# EAGLE design CORE (EAGLE 5.06)
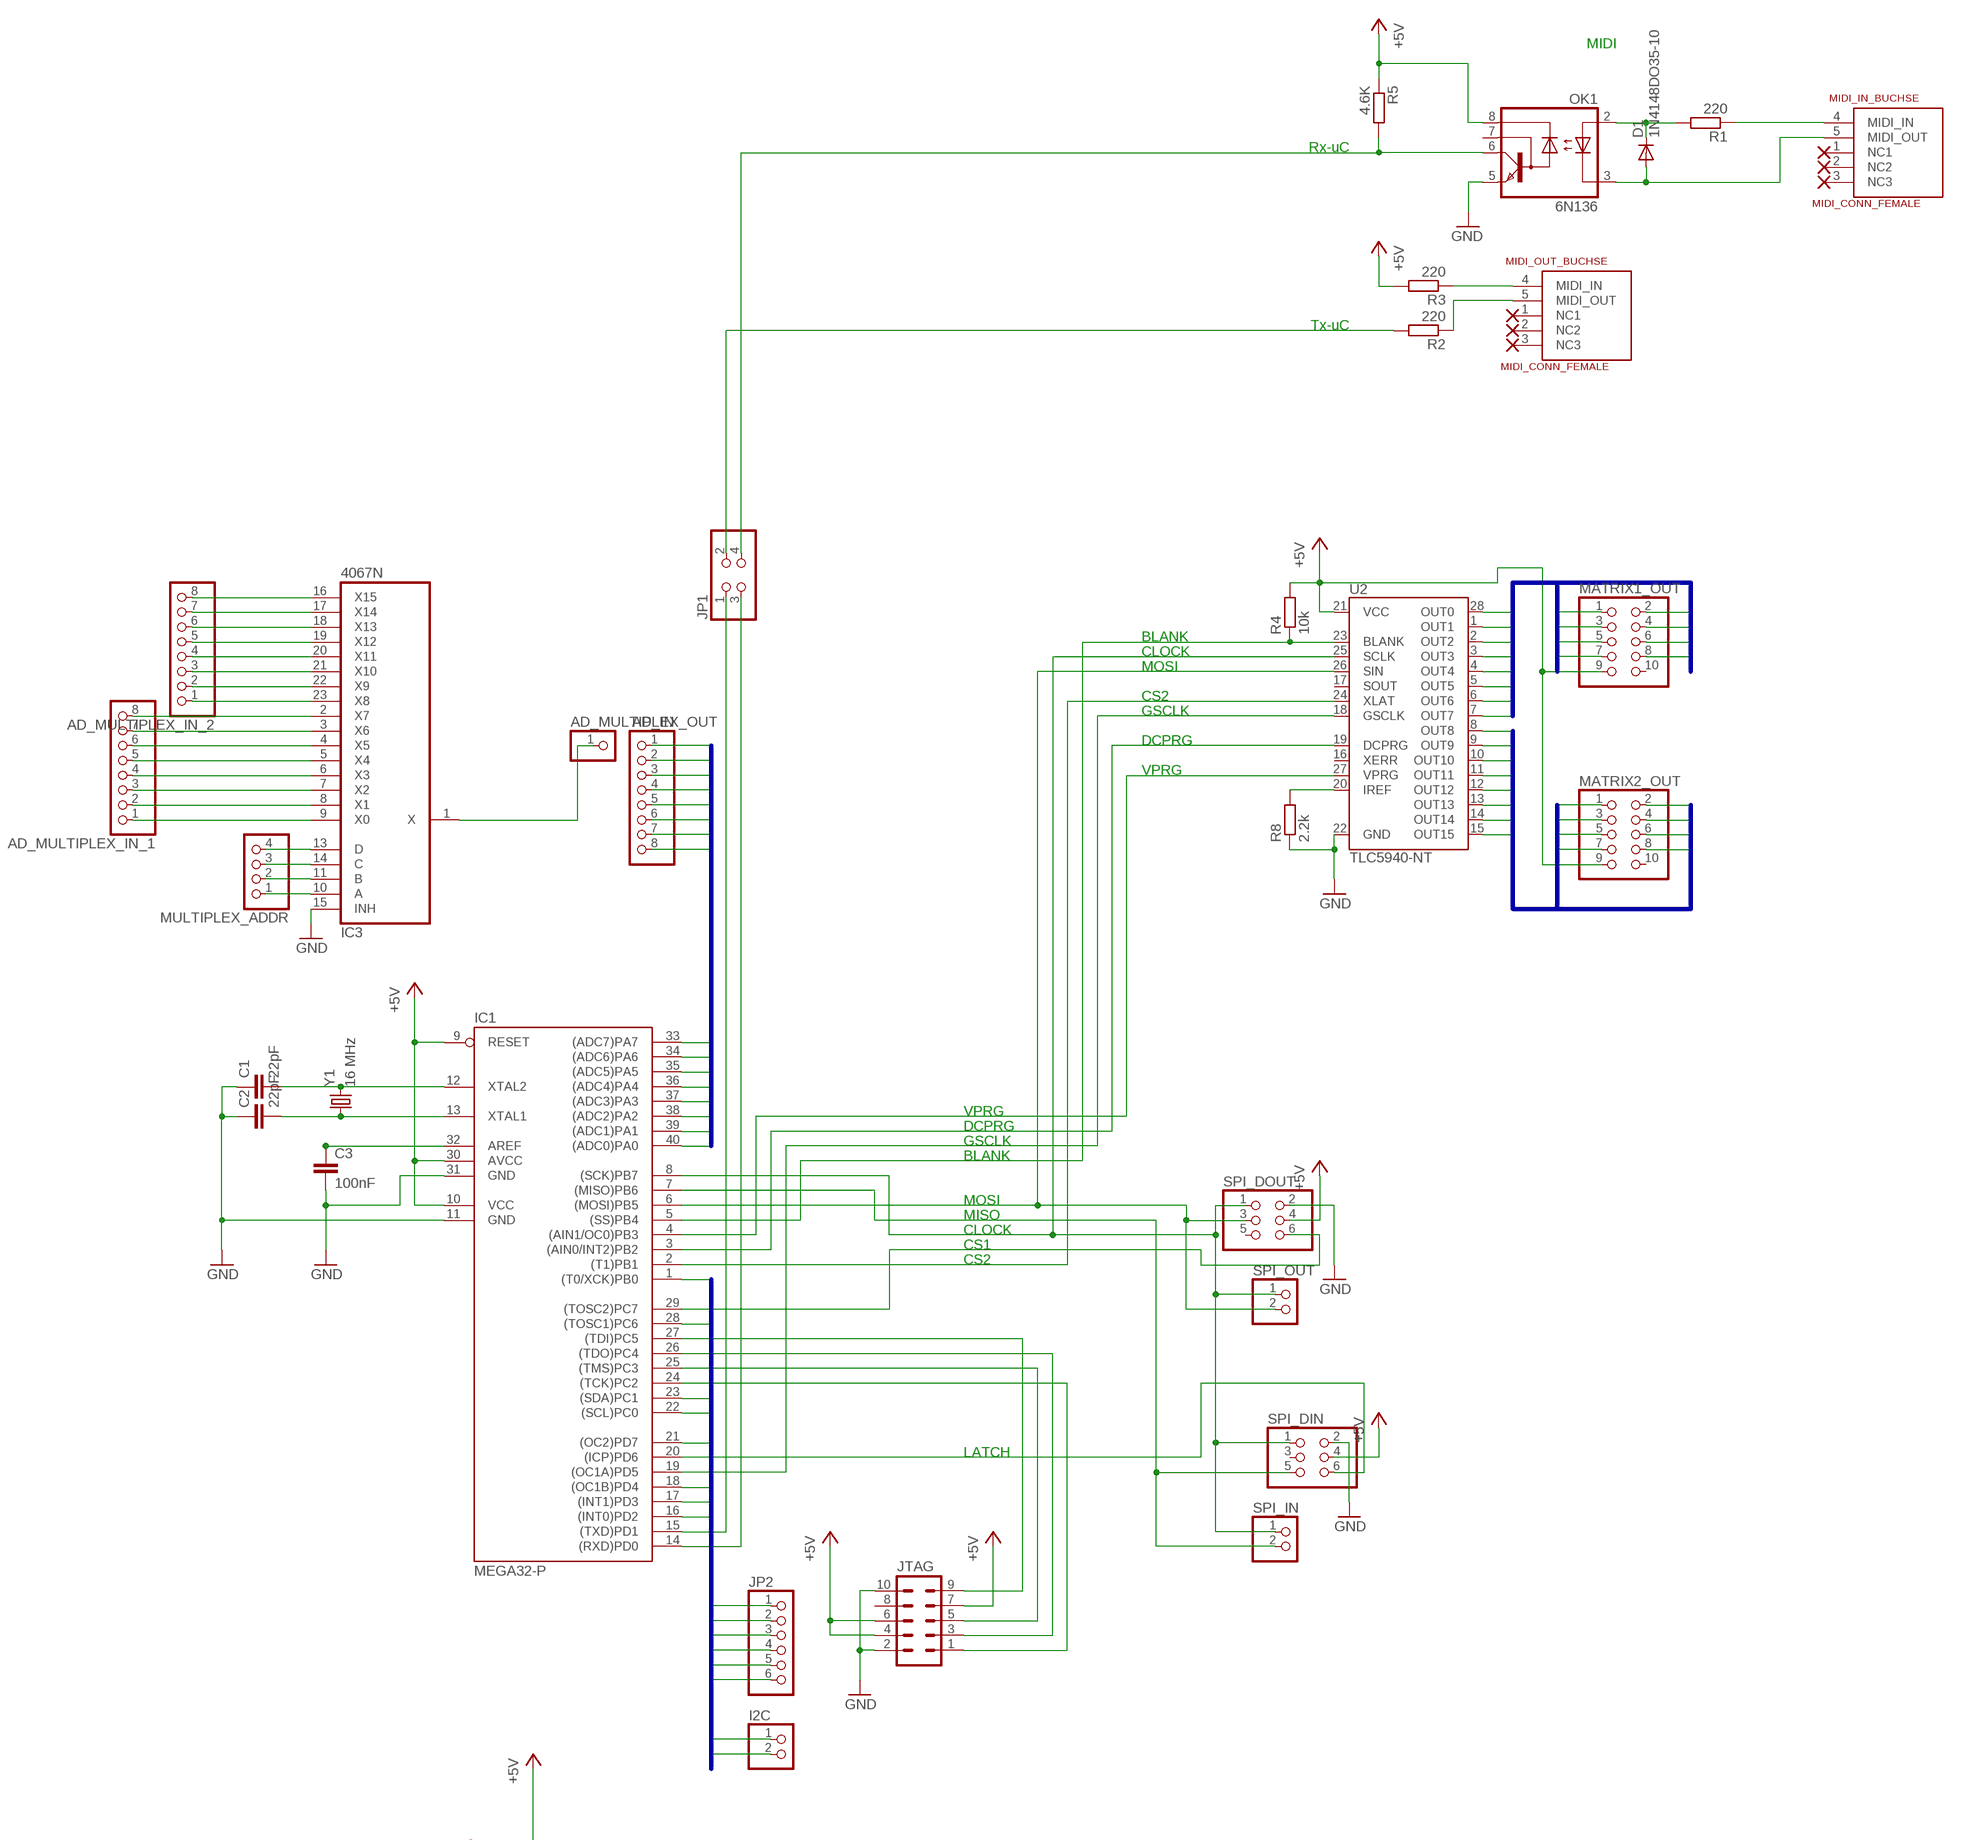
[diagram p0: schematic, sheet 1, part 1 of 2]
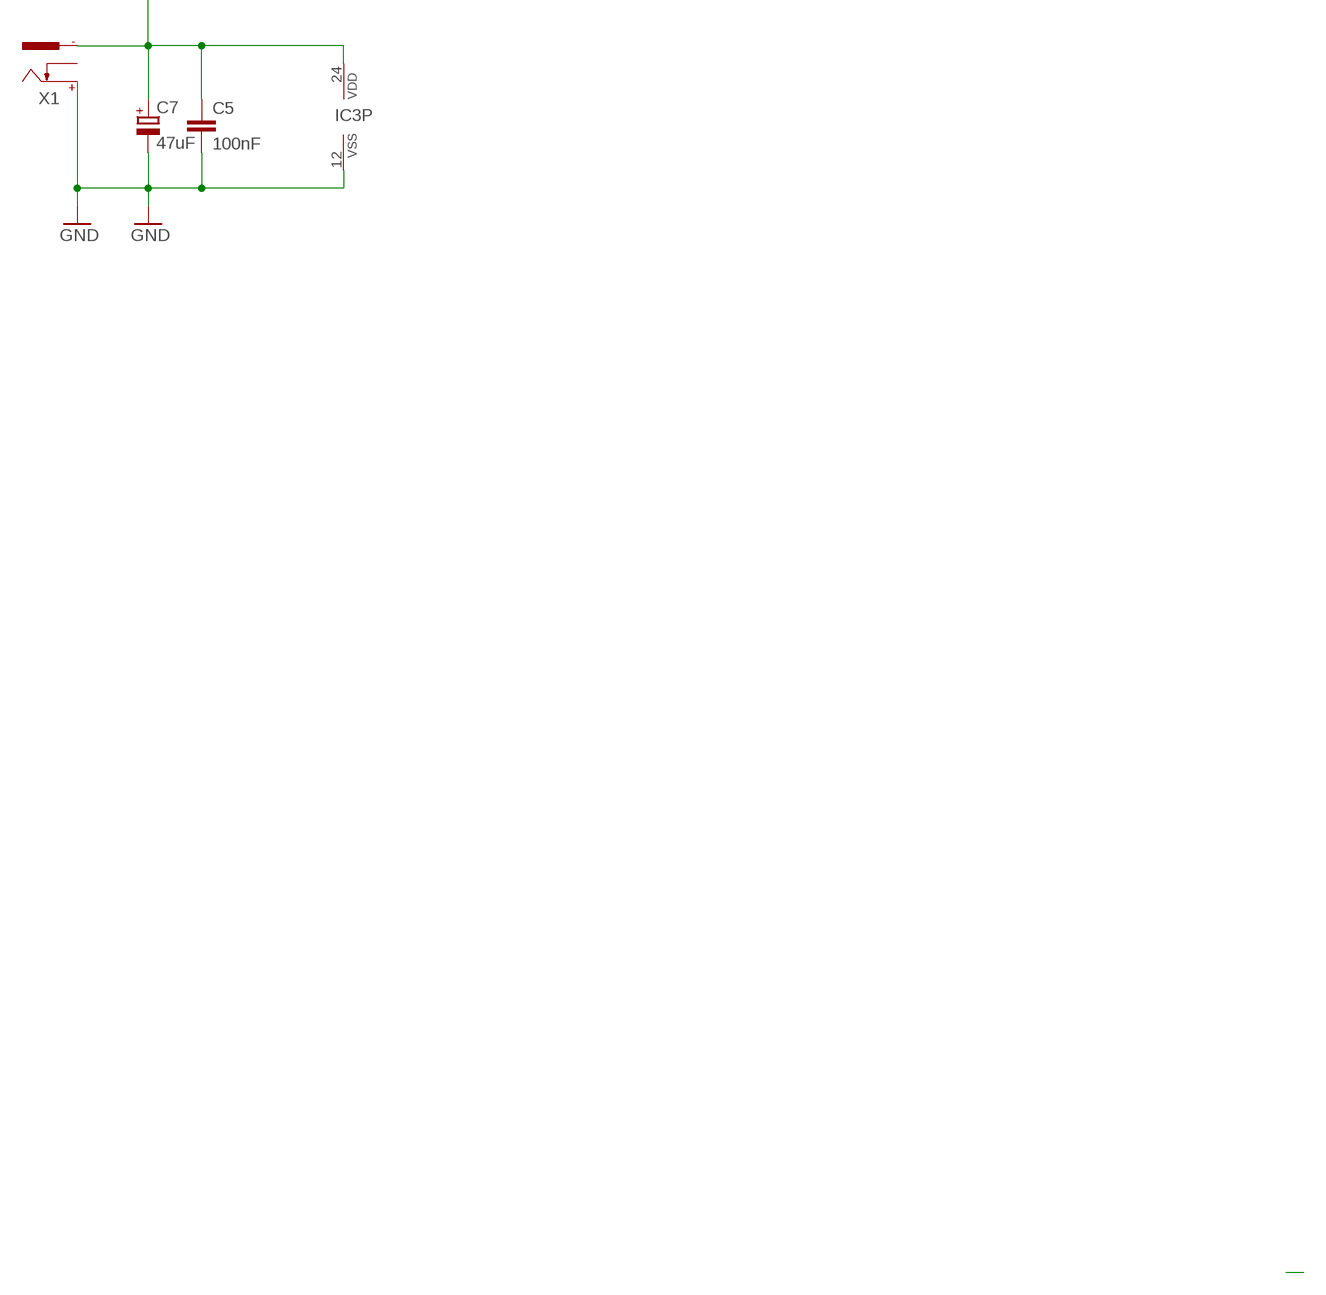
[diagram p1: schematic, sheet 1, part 2 of 2]

## Parts
AD_IN  PINHD-1X8  [1X08]
AD_MULTIPLEX_IN_1  PINHD-1X8  [1X08]
AD_MULTIPLEX_IN_2  PINHD-1X8  [1X08]
AD_MULTIPLEX_OUT  PINHD-1X1  [1X01]
C1  22pF  C-EU025-024X044  [C025-024X044]
C2  22pF  C-EU025-024X044  [C025-024X044]
C3  100nF  C-EU025-025X050  [C025-025X050]
C5  100nF  C-EU025-025X050  [C025-025X050]
C7  47uF  CPOL-EUE2.5-6  [E2,5-6]
D1  1N4148DO35-10  [DO35-10]
I2C  PINHD-1X2  [1X02]
IC1  MEGA32-P  [DIL40]
IC3  4067N  [DIL24-6]
JP1  PINHD-2X2  [2X02]
JP2  PINHD-1X6  [1X06]
JTAG  ML10  [ML10]
MATRIX1_OUT  PINHD-2X5  [2X05]
MATRIX2_OUT  PINHD-2X5  [2X05]
MIDI_IN_BUCHSE  MIDI_CONN_FEMALE  [DIN_5_FEMALE]
MIDI_OUT_BUCHSE  MIDI_CONN_FEMALE  [DIN_5_FEMALE]
MULTIPLEX_ADDR  PINHD-1X4  [1X04]
OK1  6N136  6N135  [DIL08]
R1  220  R-EU_0207/10  [0207/10]
R2  220  R-EU_0207/10  [0207/10]
R3  220  R-EU_0207/10  [0207/10]
R4  10k  R-EU_0207/10  [0207/10]
R5  4.6K  R-EU_0207/10  [0207/10]
R8  2.2k  R-EU_0207/10  [0207/10]
SPI_DIN  PINHD-2X3  [2X03]
SPI_DOUT  PINHD-2X3  [2X03]
SPI_IN  PINHD-1X2  [1X02]
SPI_OUT  PINHD-1X2  [1X02]
U2  TLC5940-NT  [DIL28-3]
X1  737992-55  [737992-5]
Y1  16 MHz  CRYSTALHC49UV  [HC49U-V]

## Nets
+5V: C5.1 C7.+ IC1.9(RESET) IC1.10(VCC) IC1.30(AVCC) IC3.24(VDD) JTAG.4 JTAG.6 JTAG.7 MATRIX1_OUT.9 MATRIX2_OUT.9 OK1.8(VCC) R3.2 R4.2 R5.1 SPI_DIN.4 SPI_DOUT.4 U2.21(VCC) X1.-1
AD1: AD_IN.1 IC1.40((ADC0)PA0)
AD2: AD_IN.2 IC1.39((ADC1)PA1)
AD3: AD_IN.3 IC1.38((ADC2)PA2)
AD4: AD_IN.4 IC1.37((ADC3)PA3)
AD5: AD_IN.5 IC1.36((ADC4)PA4)
AD6: AD_IN.6 IC1.35((ADC5)PA5)
AD7: AD_IN.7 IC1.34((ADC6)PA6)
AD8: AD_IN.8 IC1.33((ADC7)PA7)
GND: C1.1 C2.1 C3.2 C5.2 C7.- IC1.11(GND) IC1.31(GND) IC3.12(VSS) IC3.15(INH) JTAG.2 JTAG.10 OK1.5(GND) R8.1 SPI_DIN.2 SPI_DOUT.2 U2.22(GND) X1.+
INT0/PD2: IC1.16((INT0)PD2) JP2.6
INT1/PD3: IC1.17((INT1)PD3) JP2.5
N$1: C2.2 IC1.13(XTAL1) Y1.1
N$2: C1.2 IC1.12(XTAL2) Y1.2
N$3: IC1.2((T1)PB1) U2.24(XLAT)
N$4: AD_MULTIPLEX_OUT.1 IC3.1(X)
N$5: AD_MULTIPLEX_IN_1.1 IC3.9(X0)
N$6: AD_MULTIPLEX_IN_1.2 IC3.8(X1)
N$7: AD_MULTIPLEX_IN_1.3 IC3.7(X2)
N$8: AD_MULTIPLEX_IN_1.4 IC3.6(X3)
N$9: AD_MULTIPLEX_IN_1.5 IC3.5(X4)
N$10: AD_MULTIPLEX_IN_1.6 IC3.4(X5)
N$11: AD_MULTIPLEX_IN_1.7 IC3.3(X6)
N$12: AD_MULTIPLEX_IN_1.8 IC3.2(X7)
N$13: AD_MULTIPLEX_IN_2.1 IC3.23(X8)
N$14: AD_MULTIPLEX_IN_2.2 IC3.22(X9)
N$15: JP1.4 OK1.6(VO) R5.2
N$16: AD_MULTIPLEX_IN_2.3 IC3.21(X10)
N$17: AD_MULTIPLEX_IN_2.4 IC3.20(X11)
N$18: AD_MULTIPLEX_IN_2.5 IC3.19(X12)
N$19: IC1.6((MOSI)PB5) SPI_DOUT.3 SPI_OUT.2 U2.26(SIN)
N$20: AD_MULTIPLEX_IN_2.6 IC3.18(X13)
N$21: AD_MULTIPLEX_IN_2.7 IC3.17(X14)
N$22: AD_MULTIPLEX_IN_2.8 IC3.16(X15)
N$23: IC3.13(D) MULTIPLEX_ADDR.4
N$24: IC3.14(C) MULTIPLEX_ADDR.3
N$25: IC1.5((SS)PB4) R4.1 U2.23(BLANK)
N$26: R8.2 U2.20(IREF)
N$27: IC1.19((OC1A)PD5) U2.18(GSCLK)
N$28: IC1.3((AIN0/INT2)PB2) U2.19(DCPRG)
N$29: IC1.4((AIN1/OC0)PB3) U2.27(VPRG)
N$30: IC3.11(B) MULTIPLEX_ADDR.2
N$31: IC1.8((SCK)PB7) SPI_DIN.1 SPI_DOUT.1 SPI_IN.1 SPI_OUT.1 U2.25(SCLK)
N$32: C3.1 IC1.32(AREF)
N$33: IC3.10(A) MULTIPLEX_ADDR.1
N$34: IC1.7((MISO)PB6) SPI_DIN.5 SPI_IN.2
N$35: IC1.14((RXD)PD0) JP1.3
N$36: JP1.2 R2.2
N$51: IC1.24((TCK)PC2) JTAG.1
N$57: D1.A MIDI_IN_BUCHSE.5(MIDI_OUT) OK1.3(C)
N$58: D1.C OK1.2(A) R1.2
N$59: MIDI_IN_BUCHSE.4(MIDI_IN) R1.1
N$63: MIDI_OUT_BUCHSE.4(MIDI_IN) R3.1
N$64: MIDI_OUT_BUCHSE.5(MIDI_OUT) R2.1
N$65: IC1.15((TXD)PD1) JP1.1
N$71: IC1.26((TDO)PC4) JTAG.3
N$72: IC1.25((TMS)PC3) JTAG.5
N$73: IC1.27((TDI)PC5) JTAG.9
N$79: IC1.29((TOSC2)PC7) SPI_DOUT.6
N$81: IC1.20((ICP)PD6) SPI_DIN.6
OC1B/PD4: IC1.18((OC1B)PD4) JP2.4
OC2/PD7: IC1.21((OC2)PD7) JP2.3
SCL/PC0: I2C.2 IC1.22((SCL)PC0)
SDA/PC1: I2C.1 IC1.23((SDA)PC1)
T0/PB0: IC1.1((T0/XCK)PB0) JP2.1
TLCOUT1: MATRIX1_OUT.1 U2.28(OUT0)
TLCOUT2: MATRIX1_OUT.2 U2.1(OUT1)
TLCOUT3: MATRIX1_OUT.3 U2.2(OUT2)
TLCOUT4: MATRIX1_OUT.4 U2.3(OUT3)
TLCOUT5: MATRIX1_OUT.5 U2.4(OUT4)
TLCOUT6: MATRIX1_OUT.6 U2.5(OUT5)
TLCOUT7: MATRIX1_OUT.7 U2.6(OUT6)
TLCOUT8: MATRIX1_OUT.8 U2.7(OUT7)
TLCOUT9: MATRIX2_OUT.1 U2.8(OUT8)
TLCOUT10: MATRIX2_OUT.2 U2.9(OUT9)
TLCOUT11: MATRIX2_OUT.3 U2.10(OUT10)
TLCOUT12: MATRIX2_OUT.4 U2.11(OUT11)
TLCOUT13: MATRIX2_OUT.5 U2.12(OUT12)
TLCOUT14: MATRIX2_OUT.6 U2.13(OUT13)
TLCOUT15: MATRIX2_OUT.7 U2.14(OUT14)
TLCOUT16: MATRIX2_OUT.8 U2.15(OUT15)
TOSC1/PC6: IC1.28((TOSC1)PC6) JP2.2
Unconnected: JTAG.8 MATRIX1_OUT.10 MATRIX2_OUT.10 MIDI_IN_BUCHSE.1(NC1) MIDI_IN_BUCHSE.2(NC2) MIDI_IN_BUCHSE.3(NC3) MIDI_OUT_BUCHSE.1(NC1) MIDI_OUT_BUCHSE.2(NC2) MIDI_OUT_BUCHSE.3(NC3) OK1.7(VB) SPI_DIN.3 SPI_DOUT.5 U2.16(XERR) U2.17(SOUT) X1.-2 X1.K

## Buses
TLCOUT[1..8]
TLCOUT[9..16]
AD[1..8]
RESTPINS:T0/PB0,TOSC1/PC6,SDA/PC1,SCL/PC0,OC2/PD7,OC1B/PD4,INT1/PD3,INT0/PD2

## Notes on the sheet
- MIDI
- Rx-uC
- Tx-uC
- BLANK
- CLOCK
- MOSI
- CS2
- GSCLK
- DCPRG
- VPRG
- VPRG
- DCPRG
- GSCLK
- BLANK
- MOSI
- MISO
- CLOCK
- CS1
- CS2
- LATCH

## Library data of the parts
AD_IN AD_MULTIPLEX_IN_1 AD_MULTIPLEX_IN_2 = pinhead:PINHD-1X8: PIN HEADER
AD_MULTIPLEX_OUT = pinhead:PINHD-1X1: PIN HEADER
C1-C3 C5 = rcl:C-EU: CAPACITOR, European symbol
C7 = rcl:CPOL-EU: POLARIZED CAPACITOR, European symbol
D1 = diode:1N4148: DIODE high speed (Philips)
I2C SPI_IN SPI_OUT = pinhead:PINHD-1X2: PIN HEADER
IC1 = atmel:MEGA32-P: MICROCONTROLLER 32 Kbytes FLASH 2 Kbytes SRAM 1 Kbytes EEPROM USART 8-channel 10 bit ADC Source: www.atmel.com .. doc2503.pdf
IC3 = 40xx:4067: 16-channel ANALOG MULTIPLEXER
JP1 = pinhead:PINHD-2X2: PIN HEADER
JP2 = pinhead:PINHD-1X6: PIN HEADER
JTAG = con-ml:ML10: HARTING
MATRIX1_OUT MATRIX2_OUT = pinhead:PINHD-2X5: PIN HEADER
MIDI_IN_BUCHSE MIDI_OUT_BUCHSE = SparkFun:MIDI_CONN_FEMALE
MULTIPLEX_ADDR = pinhead:PINHD-1X4: PIN HEADER
OK1 = optocoupler:6N135: MOTOROLA OPTO COUPLER
R1-R5 R8 = rcl:R-EU_: RESISTOR, European symbol
SPI_DIN SPI_DOUT = pinhead:PINHD-2X3: PIN HEADER
U2 = SparkFun:TLC5940: TI TLC5940 16-channel LED Driver with Dot Correction and Grayscale PWM Control The TLC5940 is a 16-channel, constant-current sink LED driver. Each channel has an individually adjustable 4096-step grayscale PWM brightness control and a 64-step, constant-current sink (dot correction). The dot correction adjusts the brightness variations between LED channels and other LED drivers. The dot correction data is stored in an integrated EEPROM. Both grayscale control and dot correction are accessible via a serial interface. A single external resistor sets the maximum current value of all 16 channels. Packages: 28-pin HTSSOP 32-pin 5x5mm QFN 28-pin DIP
X1 = con-conrad:737992-55: FEMALE PRINT CONNECTOR DIN 45323 (34V/3A), ROKA, distributor Conrad
Y1 = SparkFun:CRYSTAL: Crystals Various standard crystals. Proven footprints. Spark Fun Electronics SKU : COM-00534

## Board
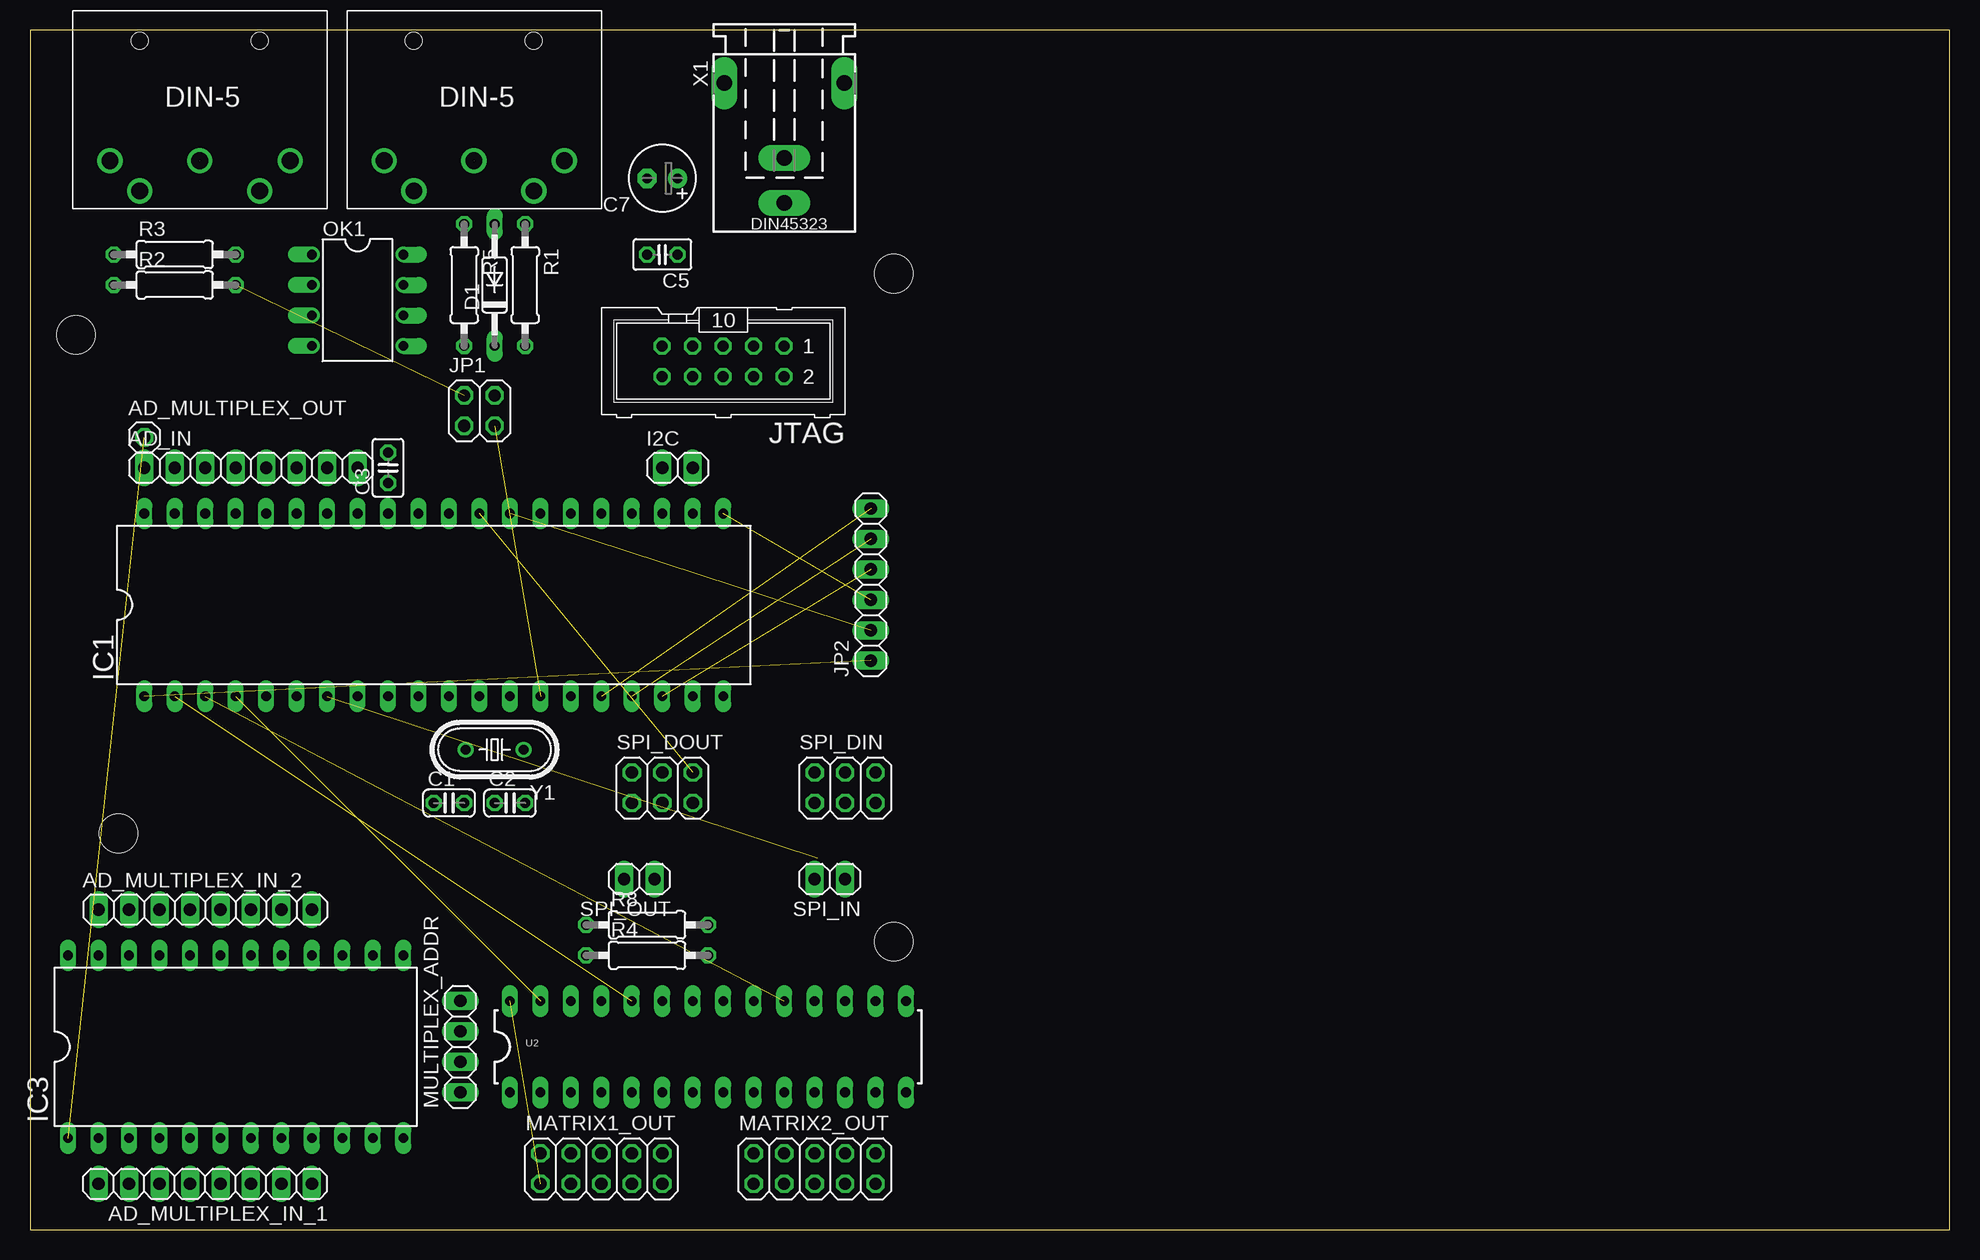
[diagram p2: board, top side]
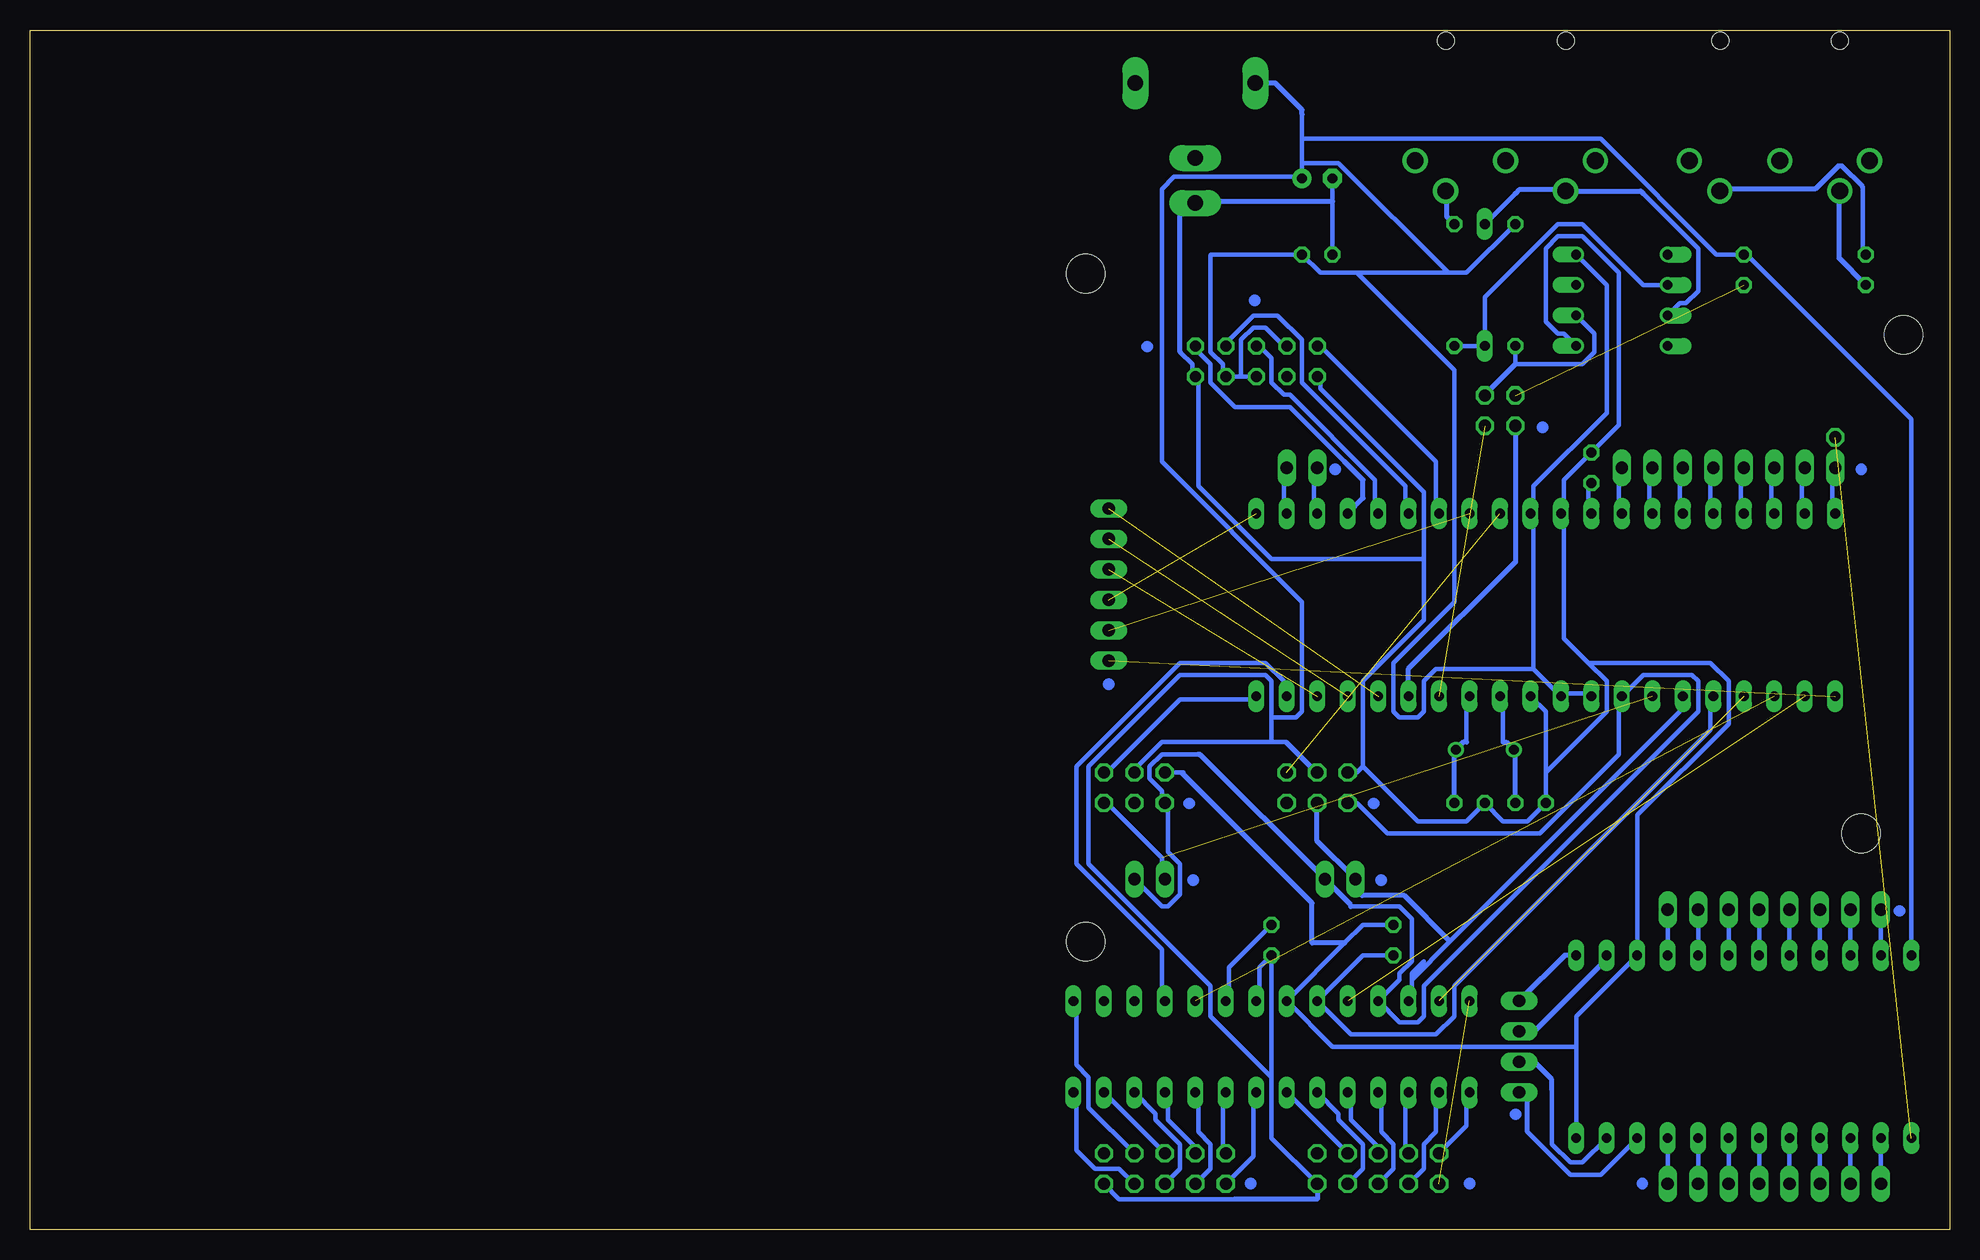
[diagram p3: board, bottom side, seen from below]

Size 160 x 100 mm. Coordinates in mm from the lower left corner, seen from the top.
Outline: 0,0 160,0 160,100 0,100 0,0
Copper layers (1*16): Top 0.018mm / dielectric 1.5mm / Bottom 0.018mm
Design rules "DRC": minimum track width 15mil, minimum drill 20mil, track to track 10mil, track to pad 10mil, pad to pad 10mil, via to via 10mil, smd to smd 8mil, copper to edge 80mil, drill to drill 20mil, minimum pad ring 10mil, minimum via ring 10mil, stop-mask expansion 4mil, vias tented up to drill 0mil, thermal gap 10mil
Holes 3.2 mm at 3.84,74.57 72.01,79.69 7.37,33.02 72.01,24

### Footprints (pad centres in the part's own frame; a part is rotated, then mirrored left to right if it is on the bottom)
1X08 = drill 1.016 long: 1 -8.89,0; 2 -6.35,0; 3 -3.81,0; 4 -1.27,0; 5 1.27,0; 6 3.81,0; 7 6.35,0; 8 8.89,0
1X01 = drill 1.016 octagon: 1 0,0
C025-024X044 = drill 0.813 octagon: 1 -1.27,0; 2 1.27,0
C025-025X050 = drill 0.813 octagon: 1 -1.27,0; 2 1.27,0
E2,5-6 = drill 0.813 pad 1.6 round: + -1.27,0 | drill 0.813 pad 1.6 octagon: - 1.27,0
DO35-10 = drill 0.813 long: A 5.08,0; C -5.08,0
1X02 = drill 1.016 long: 1 -1.27,0; 2 1.27,0
DIL40 = drill 0.813 long: 1 -24.13,-7.62; 2 -21.59,-7.62; 3 -19.05,-7.62; 4 -16.51,-7.62; 5 -13.97,-7.62; 6 -11.43,-7.62; 7 -8.89,-7.62; 8 -6.35,-7.62; 9 -3.81,-7.62; 10 -1.27,-7.62; 11 1.27,-7.62; 12 3.81,-7.62; 13 6.35,-7.62; 14 8.89,-7.62; 15 11.43,-7.62; 16 13.97,-7.62; 17 16.51,-7.62; 18 19.05,-7.62; 19 21.59,-7.62; 20 24.13,-7.62; 21 24.13,7.62; 22 21.59,7.62; 23 19.05,7.62; 24 16.51,7.62; 25 13.97,7.62; 26 11.43,7.62; 27 8.89,7.62; 28 6.35,7.62; 29 3.81,7.62; 30 1.27,7.62; 31 -1.27,7.62; 32 -3.81,7.62; 33 -6.35,7.62; 34 -8.89,7.62; 35 -11.43,7.62; 36 -13.97,7.62; 37 -16.51,7.62; 38 -19.05,7.62; 39 -21.59,7.62; 40 -24.13,7.62
DIL24-6 = drill 0.813 long: 1 -13.97,-7.62; 2 -11.43,-7.62; 3 -8.89,-7.62; 4 -6.35,-7.62; 5 -3.81,-7.62; 6 -1.27,-7.62; 7 1.27,-7.62; 8 3.81,-7.62; 9 6.35,-7.62; 10 8.89,-7.62; 11 11.43,-7.62; 12 13.97,-7.62; 13 13.97,7.62; 14 11.43,7.62; 15 8.89,7.62; 16 6.35,7.62; 17 3.81,7.62; 18 1.27,7.62; 19 -1.27,7.62; 20 -3.81,7.62; 21 -6.35,7.62; 22 -8.89,7.62; 23 -11.43,7.62; 24 -13.97,7.62
2X02 = drill 1.016 octagon: 1 -1.27,-1.27; 2 -1.27,1.27; 3 1.27,-1.27; 4 1.27,1.27
1X06 = drill 1.016 long: 1 -6.35,0; 2 -3.81,0; 3 -1.27,0; 4 1.27,0; 5 3.81,0; 6 6.35,0
ML10 = drill 0.914 octagon: 1 -5.08,-1.27; 2 -5.08,1.27; 3 -2.54,-1.27; 4 -2.54,1.27; 5 0,-1.27; 6 0,1.27; 7 2.54,-1.27; 8 2.54,1.27; 9 5.08,-1.27; 10 5.08,1.27
2X05 = drill 1.016 octagon: 1 -5.08,-1.27; 2 -5.08,1.27; 3 -2.54,-1.27; 4 -2.54,1.27; 5 0,-1.27; 6 0,1.27; 7 2.54,-1.27; 8 2.54,1.27; 9 5.08,-1.27; 10 5.08,1.27
DIN_5_FEMALE = drill 1.4 round: 1 0.46,3.61; 2 -7.07,3.6; 3 7.94,3.6; 4 -4.53,6.12; 5 5.47,6.13 | hole 1.4: -4.52,-6.38; 5.47,-6.38
1X04 = drill 1.016 long: 1 -3.81,0; 2 -1.27,0; 3 1.27,0; 4 3.81,0
DIL08 = drill 0.813 offset: 1 -3.81,-3.81; 2 -1.27,-3.81; 3 1.27,-3.81; 4 3.81,-3.81; 5 3.81,3.81; 6 1.27,3.81; 7 -1.27,3.81; 8 -3.81,3.81
0207/10 = drill 0.813 octagon: 1 -5.08,0; 2 5.08,0
2X03 = drill 1.016 octagon: 1 -2.54,-1.27; 2 -2.54,1.27; 3 0,-1.27; 4 0,1.27; 5 2.54,-1.27; 6 2.54,1.27
DIL28-3 = drill 0.813 long: 1 -16.51,-3.81; 2 -13.97,-3.81; 3 -11.43,-3.81; 4 -8.89,-3.81; 5 -6.35,-3.81; 6 -3.81,-3.81; 7 -1.27,-3.81; 8 1.27,-3.81; 9 3.81,-3.81; 10 6.35,-3.81; 11 8.89,-3.81; 12 11.43,-3.81; 13 13.97,-3.81; 14 16.51,-3.81; 15 16.51,3.81; 16 13.97,3.81; 17 11.43,3.81; 18 8.89,3.81; 19 6.35,3.81; 20 3.81,3.81; 21 1.27,3.81; 22 -1.27,3.81; 23 -3.81,3.81; 24 -6.35,3.81; 25 -8.89,3.81; 26 -11.43,3.81; 27 -13.97,3.81; 28 -16.51,3.81
737992-5 = drill 1.3 pad 2.184 long: + 0,10; -1 5,0; -2 -5,0; K 0,6.25
HC49U-V = drill 0.813 round: 1 -2.413,0; 2 2.413,0

### Placement (x,y rotation side)
AD_IN  18.41,63.5 0 top
AD_MULTIPLEX_IN_1  14.61,3.81 180 top
AD_MULTIPLEX_IN_2  14.61,26.67 0 top
AD_MULTIPLEX_OUT  9.53,66.04 0 top
C1  34.92,35.56 0 top
C2  40.01,35.56 0 top
C3  29.84,63.5 90 top
C5  52.7,81.28 180 top
C7  52.7,87.63 180 top
D1  38.73,78.74 90 top
I2C  53.98,63.5 0 top
IC1  33.66,52.07 0 top
IC3  17.14,15.24 0 top
JP1  37.47,68.26 0 top
JP2  70.09,53.77 90 top
JTAG  57.78,72.39 180 top
MATRIX1_OUT  47.62,5.08 0 top
MATRIX2_OUT  65.41,5.08 0 top
MIDI_IN_BUCHSE  37.47,92.71 180 top
MIDI_OUT_BUCHSE  14.61,92.71 180 top
MULTIPLEX_ADDR  35.88,15.24 90 top
OK1  27.3,77.47 270 top
R1  41.27,78.74 270 top
R2  12.06,78.74 0 top
R3  12.06,81.28 0 top
R4  51.44,22.86 0 top
R5  36.2,78.74 270 top
R8  51.44,25.4 0 top
SPI_DIN  67.94,36.83 0 top
SPI_DOUT  52.71,36.83 0 top
SPI_IN  66.67,29.21 180 top
SPI_OUT  50.8,29.21 180 top
U2  56.52,15.24 0 top
X1  62.87,95.57 180 top
Y1  38.73,40.01 180 top

### Tracks (layer width: path | path; a pad name or v marks a point on that pad's centre or on a via)
+5V
  Bottom 0.381: IC3.24 3.17,67.56 16.89,81.28 R3.2 19.43,81.28 29.08,90.93 53.98,90.93 | 56.52,40.64 65.66,40.64 68.2,38.1 SPI_DIN.4 | 56.52,40.64 55.31,40.64 | U2.21 57.53,19.3 57.53,21.84 R4.2 56.52,12.7 | 56.52,12.7 56.52,7.62 MATRIX1_OUT.9 | 59.56,2.54 69.22,2.54 MATRIX2_OUT.9 | 56.52,42.67 56.52,45.72 57.02,46.23 64.14,46.23 71.75,38.61 71.75,30.48 61.59,20.32 61.59,17.78 56.52,12.7 | 56.52,42.67 56.52,40.64 | IC1.9 30.1,44.7 32.13,44.7 IC1.10 34.67,46.74 | 34.67,46.74 34.67,59.44 IC1.30 34.67,59.94 34.67,61.98 28.57,68.07 28.57,78.74 OK1.8 | 53.98,90.93 53.98,92.96 | 53.98,90.93 53.98,88.9 | 53.98,88.9 53.98,87.76 | 59.05,71.12 JTAG.6 | 59.05,71.12 JTAG.4 60.58,71.12 60.58,72.14 61.59,73.15 61.59,81.21 61.52,81.28 C5.1 52.45,79.76 49.4,79.76 | 59.05,71.12 59.05,74.17 58.04,75.18 57.02,75.18 55.5,73.66 JTAG.7 | 41.78,79.76 40.26,79.76 R5.1 | 41.78,79.76 49.4,79.76 | 53.98,88.9 50.93,88.9 41.78,79.76 | 34.67,46.74 42.8,46.74 43.81,45.72 43.81,43.18 44.32,42.67 45.85,42.67 46.35,43.18 46.35,47.24 41.27,52.32 41.27,71.63 49.4,79.76 | 56.52,42.67 54.48,42.67 53.98,43.18 53.98,52.32 65.66,64.01 65.66,86.74 64.64,87.76 53.98,87.76 | 53.98,87.76 C7.+
  Bottom 0.406: 53.98,92.96 53.98,93.34 56.2,95.57 X1.-1 | SPI_DOUT.4 52.77,38.1 55.31,40.64 | 59.56,2.54 52.7,2.54 MATRIX1_OUT.9
AD1
  Bottom 0.381: IC1.40 9.78,59.94 9.78,63.5 AD_IN.1
AD2
  Bottom 0.381: IC1.39 12.32,59.94 12.32,63.5 AD_IN.2
AD3
  Bottom 0.381: IC1.38 14.86,59.94 14.86,63.5 AD_IN.3
AD4
  Bottom 0.381: IC1.37 17.4,59.94 17.4,63.5 AD_IN.4
AD5
  Bottom 0.381: IC1.36 19.94,59.94 19.94,63.5 AD_IN.5
AD6
  Bottom 0.381: IC1.35 22.48,59.94 22.48,63.5 AD_IN.6
AD7
  Bottom 0.381: IC1.34 25.02,59.94 25.02,63.5 AD_IN.7
AD8
  Bottom 0.381: IC1.33 27.56,59.94 27.56,63.5 AD_IN.8
GND
  Bottom 0.381: 31.11,15.24 31.11,17.78 IC3.15 26.04,34.54 18.41,42.16 18.41,45.72 19.94,47.24 30.1,47.24 | IC3.12 31.11,15.24 | R8.1 48.9,25.4 50.42,23.88 U2.22 51.44,15.24 31.11,15.24 | SPI_DIN.2 64.01,38.1 63.87,38.1 | C5.2 51.44,85.72 C7.- | 64.14,73.15 63.12,72.14 63.12,71.12 JTAG.2 62.61,71.12 62.61,61.98 56.52,55.88 43.81,55.88 | OK1.5 32.13,74.68 32.64,74.68 33.66,75.69 33.66,81.79 32.64,82.8 30.61,82.8 27.56,79.76 27.56,67.06 C3.2 32.13,62.48 32.13,59.94 IC1.31 32.13,59.44 32.13,49.28 30.1,47.24 | 33.66,38.1 33.66,43.18 IC1.11 | 33.66,38.1 C1.1 35.18,34.04 37.21,34.04 C2.1 40.26,34.04 44.32,34.04 48.9,38.61 | 43.81,55.88 43.81,50.8 48.9,45.72 48.9,38.61 | 43.81,55.88 43.81,61.47 52.45,70.1 52.45,71.12 JTAG.10 | 48.9,38.61 49.4,38.1 SPI_DOUT.2 | 30.1,47.24 28.57,45.72 28.57,43.18 33.66,38.1
  Bottom 0.406: 51.44,85.72 62.87,85.72 X1.+ 64.14,85.57 64.14,73.15 | 50.42,23.88 53.13,23.88 53.13,27.22 64.01,38.1
INT0/PD2  (1 unrouted)
INT1/PD3  (1 unrouted)
N$1
  Bottom 0.381: 40.26,40.64 40.26,44.2 IC1.13
  Bottom 0.406: C2.2 41.27,39.88 Y1.1 40.51,40.64 40.26,40.64
N$2
  Bottom 0.381: 37.21,40.64 37.21,44.2 IC1.12
  Bottom 0.406: C1.2 36.2,39.88 Y1.2 36.96,40.64 37.21,40.64
N$3  (1 unrouted)
N$4  (1 unrouted)
N$5
  Bottom 0.381: AD_MULTIPLEX_IN_1.1 IC3.9
N$6
  Bottom 0.381: AD_MULTIPLEX_IN_1.2 IC3.8
N$7
  Bottom 0.381: AD_MULTIPLEX_IN_1.3 IC3.7
N$8
  Bottom 0.381: AD_MULTIPLEX_IN_1.4 IC3.6
N$9
  Bottom 0.381: AD_MULTIPLEX_IN_1.5 IC3.5
N$10
  Bottom 0.381: AD_MULTIPLEX_IN_1.6 IC3.4
N$11
  Bottom 0.381: AD_MULTIPLEX_IN_1.7 IC3.3
N$12
  Bottom 0.381: AD_MULTIPLEX_IN_1.8 IC3.2
N$13
  Bottom 0.381: IC3.23 AD_MULTIPLEX_IN_2.1
N$14
  Bottom 0.381: IC3.22 AD_MULTIPLEX_IN_2.2
N$15
  Bottom 0.381: R5.2 36.2,72.14 30.61,72.14 29.59,73.15 29.59,74.68 OK1.6
  Bottom 0.406: JP1.4 38.73,69.6 36.2,72.14
N$16
  Bottom 0.381: IC3.21 AD_MULTIPLEX_IN_2.3
N$17
  Bottom 0.381: IC3.20 AD_MULTIPLEX_IN_2.4
N$18
  Bottom 0.381: IC3.19 AD_MULTIPLEX_IN_2.5
N$19
  Bottom 0.381: 44.83,20.83 44.83,21.34 43.81,22.35 | 44.83,20.83 44.83,19.3 U2.26 | 44.83,20.83 41.63,24.03 22.48,43.18 22.48,44.2 IC1.6
  Bottom 0.406: SPI_DOUT.3 52.71,32.39 SPI_OUT.2 49.53,28.41 48.97,27.84 45.45,27.84 41.63,24.03
N$20
  Bottom 0.381: IC3.18 AD_MULTIPLEX_IN_2.6
N$21
  Bottom 0.381: IC3.17 AD_MULTIPLEX_IN_2.7
N$22
  Bottom 0.381: IC3.16 AD_MULTIPLEX_IN_2.8
N$23
  Bottom 0.406: IC3.13 32.07,22.86 MULTIPLEX_ADDR.4
N$24
  Bottom 0.406: IC3.14 28.57,22.54 34.61,16.51 MULTIPLEX_ADDR.3
N$25
  Bottom 0.381: R4.1 48.9,22.86 U2.23 49.91,16.26 42.8,16.26 41.27,17.78 41.27,20.32 19.94,41.66 19.94,44.2 IC1.5
N$26
  Bottom 0.381: R8.2 60.07,21.84 60.07,19.3 U2.20
N$27
  Bottom 0.381: U2.18 65.66,19.3 65.66,23.37 72.77,30.48 72.77,38.61 64.14,47.24 57.02,47.24 55.5,45.72 55.5,44.7 IC1.19
N$28  (1 unrouted)
N$29  (1 unrouted)
N$30
  Bottom 0.381: IC3.11 30.61,5.59 31.62,5.59 33.15,7.11 33.15,11.68
  Bottom 0.406: 33.15,11.68 33.15,12.51 34.61,13.97 MULTIPLEX_ADDR.2
N$31
  Bottom 0.381: SPI_DOUT.1 49.4,35.56 46.86,33.02 34.16,33.02 27.56,39.62 27.56,44.2 IC1.8 25.53,46.23 21.46,46.23 20.95,45.72 20.95,43.18 43.81,20.32 43.81,17.78 44.32,17.27 45.85,17.27 U2.25 45.85,20.83 45.85,21.34 44.83,22.35 44.83,25.91 45.85,26.92 49.91,26.92 | SPI_IN.1 65.66,26.92 65.15,26.92 64.14,27.94 64.14,30.48 65.15,31.5 65.15,35.56 SPI_DIN.1 65.66,35.56 65.66,36.58 66.67,37.59 66.67,38.61 65.66,39.62 62.61,39.62
  Bottom 0.406: 49.91,26.92 49.91,27.05 SPI_OUT.1 62.48,39.62 62.61,39.62
N$32
  Bottom 0.381: IC1.32 30.1,59.94 30.1,61.98 C3.1
N$33
  Bottom 0.381: IC3.10 29.08,4.57 31.62,4.57 35.18,8.13
  Bottom 0.406: 35.18,8.13 35.18,10.73 MULTIPLEX_ADDR.1
N$34  (1 unrouted)
  Bottom 0.381: SPI_IN.2 65.66,29.46 65.66,30.99 70.23,35.56 SPI_DIN.5
N$35  (1 unrouted)
N$36  (1 unrouted)
N$51
  Bottom 0.381: 50.42,64.01 54.99,68.58 59.56,68.58 61.59,70.61 61.59,72.14 63.12,73.66 JTAG.1 | IC1.24 50.42,59.94
  Bottom 0.406: 50.42,64.01 48.9,62.48 48.9,60.96 IC1.24
N$57
  Bottom 0.381: OK1.3 22.48,77.22 21.97,77.22 20.95,78.23 20.95,81.79 25.53,86.36 | 36.2,86.36 D1.A
  Bottom 0.406: 36.2,86.36 35.88,86.68 32.09,86.68 MIDI_IN_BUCHSE.5 25.75,86.58 25.53,86.36
N$58
  Bottom 0.381: R1.2 D1.C 38.73,77.72 32.64,83.82 30.61,83.82 25.53,78.74 OK1.2
N$59
  Bottom 0.406: R1.1 41.91,84.45 41.91,86.5 MIDI_IN_BUCHSE.4
N$63
  Bottom 0.381: 7.24,86.87 7.24,81.28 R3.1
  Bottom 0.406: 7.24,86.87 7.24,86.93 8.96,88.65 9.28,88.65 11.2,86.73 18.99,86.73 MIDI_OUT_BUCHSE.4
N$64
  Bottom 0.406: R2.1 9.21,80.96 9.21,86.51 MIDI_OUT_BUCHSE.5
N$65
  Bottom 0.406: IC1.15 45.09,46.77 36.16,55.69 36.16,66.96 JP1.1
N$71
  Bottom 0.381: IC1.26 45.34,59.94 45.34,61.98 53.98,70.61 53.98,74.17 56.01,76.2 58.04,76.2 60.58,73.66 JTAG.3
N$72
  Bottom 0.381: IC1.25 47.88,59.94 47.88,62.48 54.99,69.6 55.5,69.6 56.52,70.61 56.52,72.64 57.53,73.66 JTAG.5
N$73
  Bottom 0.381: IC1.27 42.8,59.94 42.8,64.01 52.45,73.66 JTAG.9
N$79  (1 unrouted)
N$81
  Bottom 0.381: IC1.20 58.04,44.2 64.14,44.2 70.23,38.1 SPI_DIN.6
OC1B/PD4  (1 unrouted)
OC2/PD7  (1 unrouted)
SCL/PC0
  Bottom 0.381: IC1.22 55.5,59.94 55.5,63.5 I2C.2
SDA/PC1
  Bottom 0.381: IC1.23 52.96,59.94 52.96,63.5 I2C.1
T0/PB0  (1 unrouted)
TLCOUT1  (1 unrouted)
TLCOUT2
  Bottom 0.381: U2.1 40.26,11.18 40.26,8.64 MATRIX1_OUT.2
TLCOUT3
  Bottom 0.381: U2.2 42.8,11.18 42.8,8.13 43.81,7.11 43.81,5.08 MATRIX1_OUT.3
TLCOUT4
  Bottom 0.381: U2.3 45.34,11.18 45.34,6.6 MATRIX1_OUT.4
TLCOUT5
  Bottom 0.381: U2.4 47.37,11.18 47.37,8.13 46.35,7.11 46.35,5.08 MATRIX1_OUT.5
TLCOUT6
  Bottom 0.381: U2.5 49.91,11.18 49.91,9.14 47.37,6.6 MATRIX1_OUT.6
TLCOUT7
  Bottom 0.381: U2.6 50.93,9.65 50.93,9.14 48.9,7.11 48.9,5.08 MATRIX1_OUT.7
TLCOUT8
  Bottom 0.381: MATRIX1_OUT.8 U2.7
TLCOUT9
  Bottom 0.381: U2.8 58.04,11.18 58.04,6.1 MATRIX2_OUT.1
TLCOUT10
  Bottom 0.381: U2.9 60.58,11.18 60.58,6.6 MATRIX2_OUT.2
TLCOUT11
  Bottom 0.381: U2.10 62.61,11.18 62.61,8.13 61.59,7.11 61.59,5.08 MATRIX2_OUT.3
TLCOUT12
  Bottom 0.381: U2.11 65.15,11.18 65.15,9.14 62.61,6.6 MATRIX2_OUT.4
TLCOUT13
  Bottom 0.381: U2.12 66.17,9.65 66.17,9.14 64.14,7.11 64.14,5.08 MATRIX2_OUT.5
TLCOUT14
  Bottom 0.381: MATRIX2_OUT.6 U2.13
TLCOUT15
  Bottom 0.381: U2.14 72.77,11.18 72.77,6.6 71.25,5.08 69.22,5.08 MATRIX2_OUT.7
TLCOUT16
  Bottom 0.381: U2.15 72.77,18.8 72.77,13.72 71.75,12.7 71.75,10.16 MATRIX2_OUT.8
TOSC1/PC6  (1 unrouted)
(copper drawn outside any net)
  shapes: Bottom circle x15